# Altium schematic sheet Peripherals.SchDoc
size A4; SheetNumber: 3; SheetTotal: 4
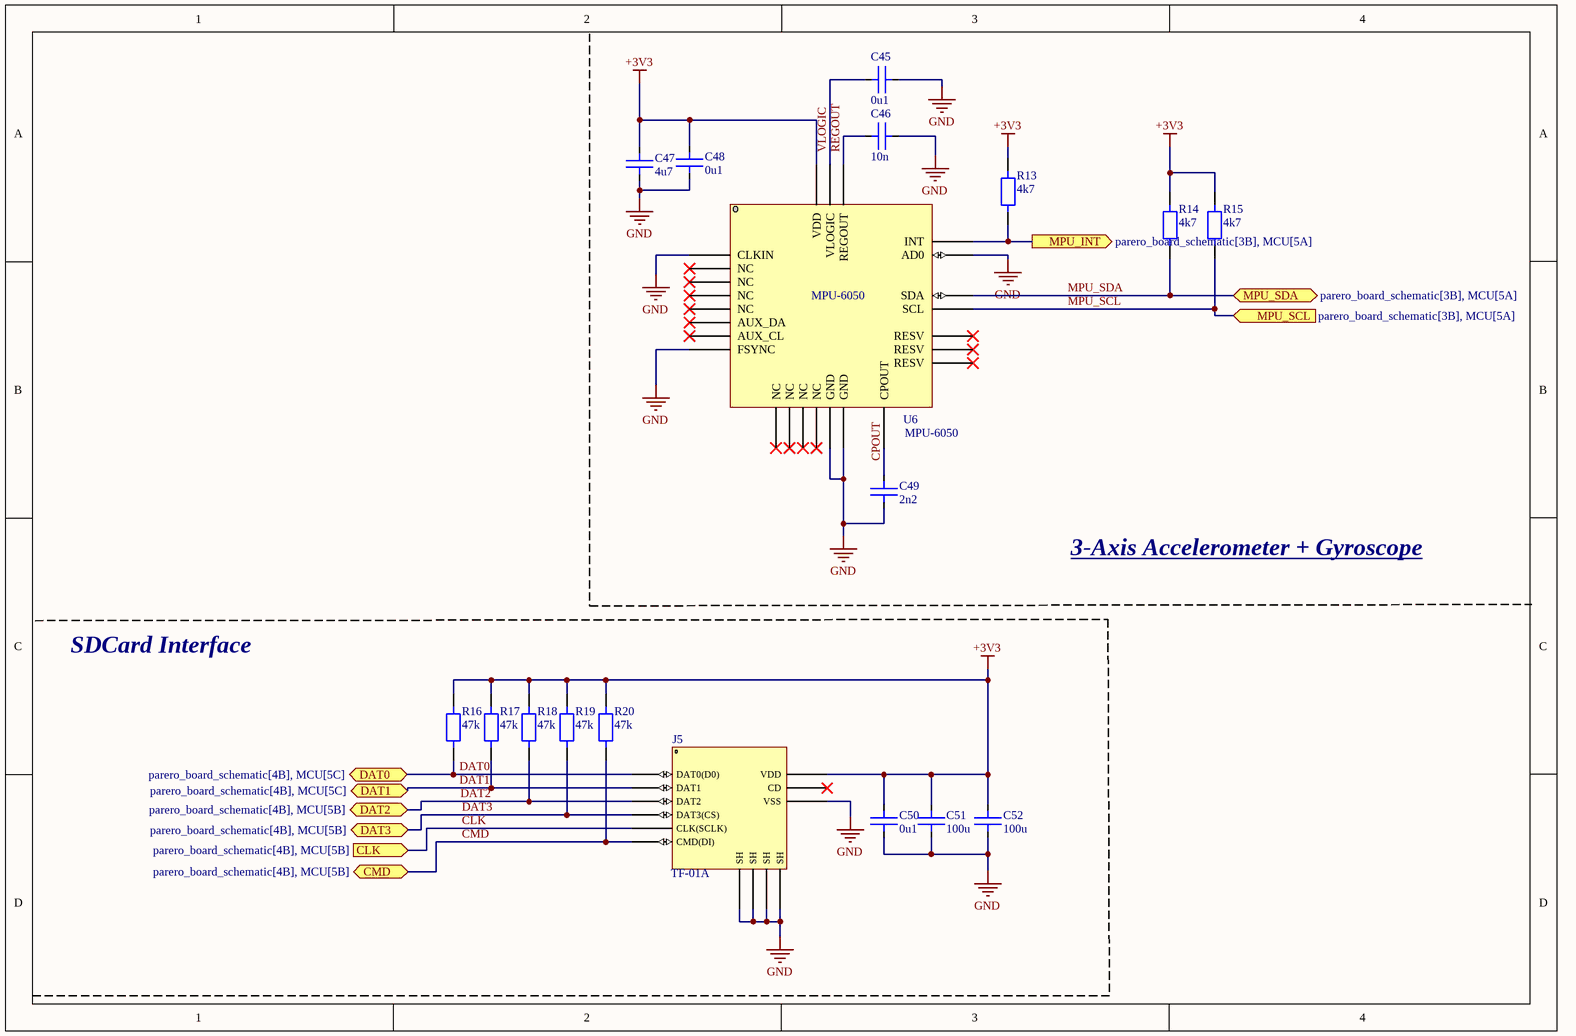
[diagram p0: Peripherals.SchDoc]

## Parts
C45  0u1  [CAP_MLCC_0402]
C46  10n  [CAP_MLCC_0402]
C47  4u7  [CAP_MLCC_0603]
C48  0u1  [CAP_MLCC_0402]
C49  2n2  [CAP_MLCC_0402]
C50  0u1  [CAP_MLCC_0402]
C51  100u  [CAP_MLCC_1206]
C52  100u  [CAP_MLCC_1206]
J5  TF-01A  [CONN_CH_SMD_SD_CARD]
R13  4k7  [RES_SMD_0402]
R14  4k7  [RES_SMD_0402]
R15  4k7  [RES_SMD_0402]
R16  47k  [RES_SMD_0402]
R17  47k  [RES_SMD_0402]
R18  47k  [RES_SMD_0402]
R19  47k  [RES_SMD_0402]
R20  47k  [RES_SMD_0402]
U6  MPU-6050  [MPU-6050]

## Ports
CLK (in, see parero_board_schematic[4B], MCU[5B]), CMD (bidir, see parero_board_schematic[4B], MCU[5B]), DAT0 (bidir, see parero_board_schematic[4B], MCU[5C]), DAT1 (bidir, see parero_board_schematic[4B], MCU[5C]), DAT2 (bidir, see parero_board_schematic[4B], MCU[5B]), DAT3 (bidir, see parero_board_schematic[4B], MCU[5B]), MPU_INT (out, see parero_board_schematic[3B], MCU[5A]), MPU_SCL (in, see parero_board_schematic[3B], MCU[5A]), MPU_SDA (bidir, see parero_board_schematic[3B], MCU[5A])

## Nets
+3V3: C47.2 C48.2 C50.2 C51.2 C52.2 J5.4(VDD) R13.2 R14.2 R15.2 R16.2 R17.2 R18.2 R19.2 R20.2 U6.13(VDD)
GND: C45.1 C46.1 C47.1 C48.1 C49.1 C50.1 C51.1 C52.1 J5.6(VSS) J5.10(SH) J5.11(SH) J5.12(SH) J5.13(SH) U6.1(CLKIN) U6.9(AD0) U6.11(FSYNC) U6.18(GND) U6.25(GND)
CLK: J5.5(CLK(SCLK)) ; port CLK
CMD: J5.3(CMD(DI)) R20.1 ; port CMD
CPOUT: C49.2 U6.20(CPOUT)
DAT0: J5.7(DAT0(D0)) R16.1 ; port DAT0
DAT1: J5.8(DAT1) R17.1 ; port DAT1
DAT2: J5.1(DAT2) R18.1 ; port DAT2
DAT3: J5.2(DAT3(CS)) R19.1 ; port DAT3
MPU_INT: R13.1 U6.12(INT) ; port MPU_INT
MPU_SCL: R15.1 U6.23(SCL) ; port MPU_SCL
MPU_SDA: R14.1 U6.24(SDA) ; port MPU_SDA
REGOUT: C46.2 U6.10(REGOUT)
VLOGIC: C45.2 U6.8(VLOGIC)

Not connected (* = marked no-connect by the designer): J5 9(CD)*; U6 2(NC)* 3(NC)* 4(NC)* 5(NC)* 6(AUX_DA)* 7(AUX_CL)* 14(NC)* 15(NC)* 16(NC)* 17(NC)* 19(RESV)* 21(RESV)* 22(RESV)*

## Notes on the sheet
- 3-Axis Accelerometer + Gyroscope
- SDCard Interface

## Library data of the parts
C45 C48 C50 = Cap MLCC 0402: Multilayer  Ceramic Capacitor; Manufacturer 1: Samsung Electro-Mechanics; Manufacturer Part Number 1: CL05B104KO5NNNC; Designator: C?; Quantity: *
C46 = Cap MLCC 0402: Multilayer  Ceramic Capacitor; Manufacturer 1: muRata; Manufacturer Part Number 1: GRM1555C1E103GE01D; Designator: C?; Quantity: *
C47 = Cap MLCC 0603: Multilayer  Ceramic Capacitor; Manufacturer 1: muRata; Manufacturer Part Number 1: GRM188R60J475KE19D; Designator: C?; Quantity: *
C49 = Cap MLCC 0402: Multilayer  Ceramic Capacitor; Manufacturer 1: muRata; Manufacturer Part Number 1: GRM1555C1H222GA01D; Designator: C?; Quantity: *
C51 C52 = Cap MLCC 1206: Multilayer  Ceramic Capacitor; Manufacturer 1: muRata; Manufacturer Part Number 1: GRM31CR60J107KEA8L; Designator: C?; Quantity: *
J5 = Connector SD Card CH: Push-Push 1.85mm Connector and Ejector MicroSD Card (TF Card) SMD PC Card Sockets ROHS; Manufacturer 1: Korean Hroparts Elec; Manufacturer Part Number 1: TF-01A; Quantity: *; ComponentLink1Description: Datasheet; ComponentLink1URL: https://www.lcsc.com/datasheet/C91145.pdf; ComponentLink2Description: Product Link; ComponentLink2URL: https://www.lcsc.com/product-detail/C91145.html
R13-R15 = Resistor 0402: General Purpose SMD Carbon Resistor; Manufacturer 1: UNI-ROYAL; Manufacturer Part Number 1: 0402WGF4701TCE; Quantity: *
R16-R20 = Resistor 0402: General Purpose SMD Carbon Resistor; Manufacturer 1: UNI-ROYAL; Manufacturer Part Number 1: 0402WGF4702TCE; Quantity: *
U6 = Sensor MPU-6050: Accelerometer Gyroscope I2C QFN-24-EP(4x4) Accelerometers ROHS; Manufacturer 1: TDK InvenSense; Designator: U?; Manufacturer Part Number 1: MPU-6050; Quantity: *; ComponentLink1Description: Datasheet; ComponentLink1URL: https://www.lcsc.com/datasheet/C24112.pdf; ComponentLink2Description: Product Link; ComponentLink2URL: https://www.lcsc.com/product-detail/C24112.html